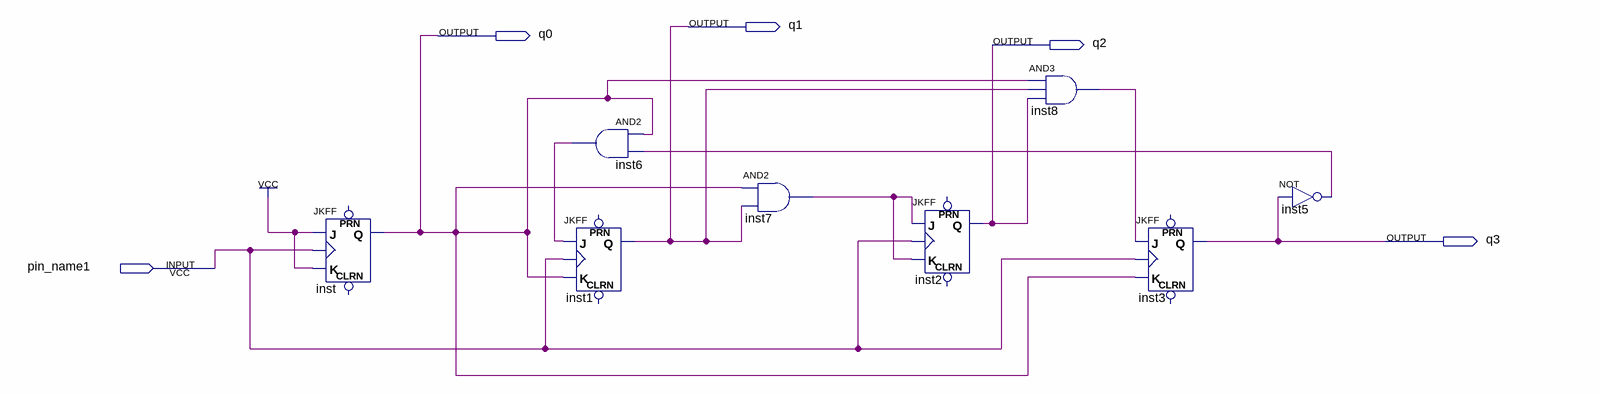
[diagram p0: schematic sheet]
// Quartus schematic numaratormodulo10.bdf as structural Verilog: 8 symbols, 5 pins
module numaratormodulo10 (
  input  pin_name1,
  output q1,
  output q0,
  output q2,
  output q3
);

  wire inst5_out, inst6_out, inst7_out, inst8_out;

  JKFF inst (.K(1'b1), .J(1'b1), .CLK(pin_name1), .Q(q0));  // open: PRN, CLRN
  and inst6 (inst6_out, q0, inst5_out);
  JKFF inst1 (.K(q0), .J(inst6_out), .CLK(pin_name1), .Q(q1));  // open: PRN, CLRN
  and inst7 (inst7_out, q0, q1);
  JKFF inst2 (.K(inst7_out), .J(inst7_out), .CLK(pin_name1), .Q(q2));  // open: PRN, CLRN
  and inst8 (inst8_out, q0, q1, q2);
  JKFF inst3 (.K(q0), .J(inst8_out), .CLK(pin_name1), .Q(q3));  // open: PRN, CLRN
  not inst5 (inst5_out, q3);
endmodule
